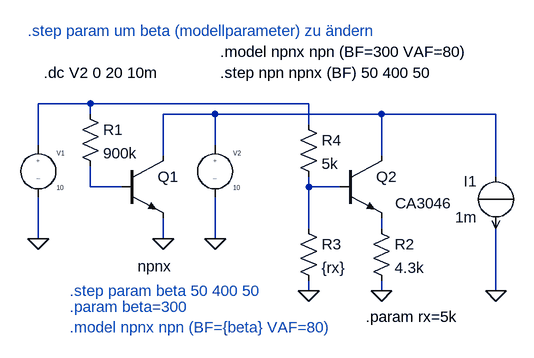
[diagram p0: schematic I-quelle.asc]
I-quelle.asc, the LTspice schematic file:
Version 4
SHEET 1 880 680
WIRE 16 96 -64 96
WIRE 352 96 16 96
WIRE 16 112 16 96
WIRE 208 112 128 112
WIRE 464 112 208 112
WIRE 640 112 464 112
WIRE 352 128 352 96
WIRE -64 160 -64 96
WIRE 208 160 208 112
WIRE 128 176 128 112
WIRE 464 176 464 112
WIRE 640 208 640 112
WIRE 16 224 16 192
WIRE 64 224 16 224
WIRE 352 224 352 208
WIRE 400 224 352 224
WIRE 352 288 352 224
WIRE 464 288 464 272
WIRE -64 304 -64 240
WIRE 128 304 128 272
WIRE 208 304 208 240
WIRE 352 384 352 368
WIRE 464 384 464 368
WIRE 640 384 640 288
FLAG 128 304 0
FLAG -64 304 0
FLAG 208 304 0
FLAG 464 384 0
FLAG 352 384 0
FLAG 640 384 0
SYMBOL EIT_Semiconductors\\npn 64 176 R0
WINDOW 3 25 170 Left 2
SYMATTR Value npnx
SYMATTR InstName Q1
SYMBOL res 0 96 R0
SYMATTR InstName R1
SYMATTR Value 900k
SYMBOL source-V -64 144 R0
SYMATTR InstName V1
SYMATTR Value 10
SYMBOL source-V 208 144 R0
SYMATTR InstName V2
SYMATTR Value 10
SYMBOL EIT_Semiconductors\\npn 400 176 R0
WINDOW 3 85 73 Left 2
SYMATTR Value CA3046
SYMATTR InstName Q2
SYMBOL res 448 272 R0
SYMATTR InstName R2
SYMATTR Value 4.3k
SYMBOL res 336 272 R0
SYMATTR InstName R3
SYMATTR Value {rx}
SYMBOL res 336 112 R0
SYMATTR InstName R4
SYMATTR Value 5k
SYMBOL source-I 640 288 R180
WINDOW 0 29 73 Left 2
WINDOW 3 29 17 Left 2
SYMATTR InstName I1
SYMATTR Value 1m
TEXT -56 48 Left 2 !.dc V2 0 20 10m
TEXT 440 424 Left 2 !.param rx=5k
TEXT -16 440 Left 2 ;.model npnx npn (BF={beta} VAF=80)
TEXT -80 -16 Left 2 ;.step param um beta (modellparameter) zu ändern
TEXT -16 408 Left 2 ;.param beta=300
TEXT -16 384 Left 2 ;.step param beta 50 400 50
TEXT 216 16 Left 2 !.model npnx npn (BF=300 VAF=80)
TEXT 216 48 Left 2 !.step npn npnx (BF) 50 400 50

The netlist it stands for:
* I-quelle.asc
Q1 N002 N003 0 0 npnx
R1 N001 N003 900k
V1 N001 0 10
V2 N002 0 10
Q2 N002 N004 N005 0 CA3046
R2 N005 0 4.3k
R3 N004 0 {rx}
R4 N001 N004 5k
I1 N002 0 1m
.model NPN NPN
.model PNP PNP
.lib standard.bjt
.dc V2 0 20 10m
.param rx=5k
* .model npnx npn (BF={beta} VAF=80)
* .step param um beta (modellparameter) zu ändern
* .param beta=300
* .step param beta 50 400 50
.model npnx npn (BF=300 VAF=80)
.step npn npnx (BF) 50 400 50
.backanno
.end